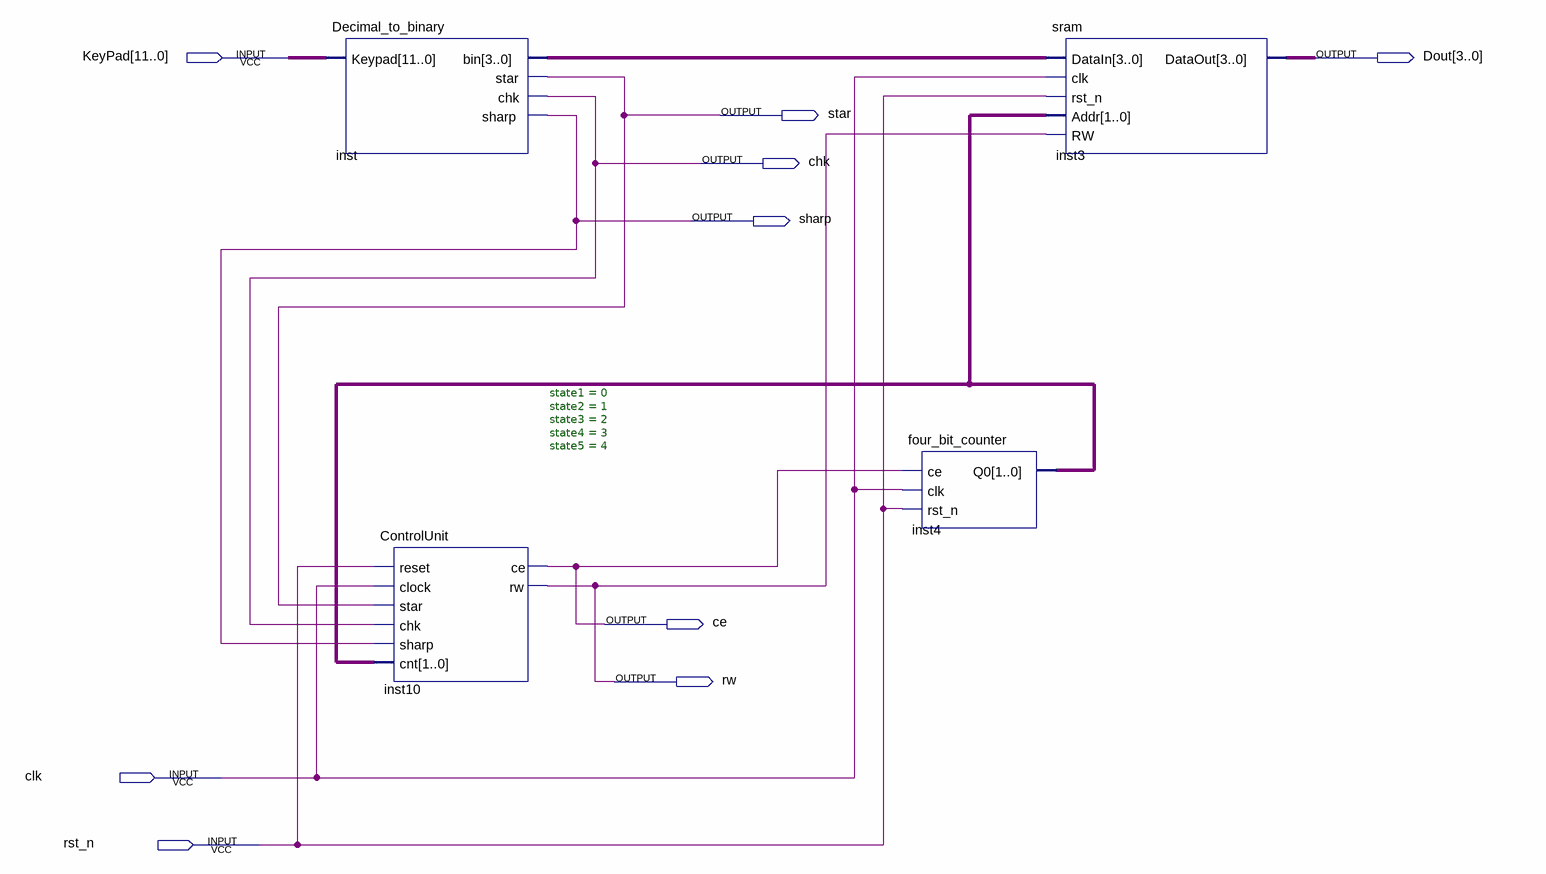
[diagram p0: schematic sheet]
// Quartus schematic Keypad_control_unit.bdf as structural Verilog: 4 symbols, 9 pins
module Keypad_control_unit (
  input  [11:0] KeyPad,
  input  clk,
  input  rst_n,
  output [3:0] Dout,
  output star,
  output chk,
  output sharp,
  output ce,
  output rw
);

  wire [1:0] inst4_q0;
  wire [3:0] inst_bin;

  Decimal_to_binary inst (.Keypad(KeyPad), .bin(inst_bin), .star(star), .chk(chk), .sharp(sharp));
  ControlUnit #(.state1(0), .state2(1), .state3(2), .state4(3), .state5(4)) inst10 (
    .reset(rst_n), .clock(clk), .star(star), .chk(chk), .sharp(sharp), .cnt(inst4_q0), .ce(ce), .rw(rw));
  four_bit_counter inst4 (.ce(ce), .clk(clk), .rst_n(rst_n), .Q0(inst4_q0));
  sram inst3 (.DataIn(inst_bin), .clk(clk), .rst_n(rst_n), .Addr(inst4_q0), .RW(rw), .DataOut(Dout));
endmodule
